# Altium schematic sheet служебный.SchDoc
size 420 x 297 mm; SheetNumber: 1; SheetTotal: 6
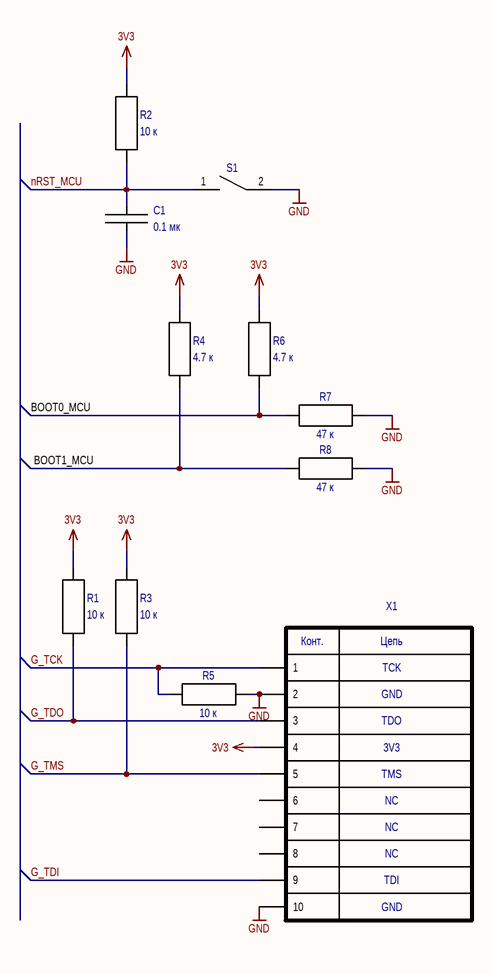
[diagram p0: служебный.SchDoc]

## Parts
C1  value 0.1 мк  (hidden comment: 0.1 мкФ ±* * * *, *)
R1  value 10 к
R2  value 10 к
R3  value 10 к
R4  value 4.7 к
R5  value 10 к
R6  value 4.7 к
R7  value 47 к
R8  value 47 к
S1  Тактильный переключатель KLS7-TS6604-4.3-180-B KLS  (value not drawn)
X1  1: GND  2: 3V3  4: TMS  6: TCK  8: TDO  10: TDI  12: NC  (hidden comment: KONT_POLE_JTAG14)

## Nets
3V3: R1.1 R2.1 R3.1 R4.1 R6.1 X1.4
GND: C1.1 R5.2 R7.2 R8.2 S1.2 X1.2 X1.10
BOOT0_MCU: R6.2 R7.1
BOOT1_MCU: R4.2 R8.1
G_TCK: R5.1 X1.1
G_TDI: X1.9
G_TDO: R1.2 X1.3
G_TMS: R3.2 X1.5
nRST_MCU: C1.2 R2.2 S1.1

Not connected (* = marked no-connect by the designer): X1 6 7 8

## Notes on the sheet
- Перв.примен.
- Справ. №
- Подп. и дата
- Инв.№ дубл.
- Взам. инв. №
- Изм.
- Лист
- № докум.
- Подп.
- Дата
- Лит.
- Масса
- Масштаб
- Пров.
- Т.контр
- Разраб.
- Схема электрическая принципиальная
- 1
- Листов
- Инв № подл.
- Н.контр.
- Утв.
- Копировал
- Формат А3
- (in symbol KONT_POLE_JTAG10) Конт.; Цепь

## Library data of the parts
C1 = C: Company: *; PartNumber: *; Tolerance: *; Voltage: *; Type: *; Package: *
R1-R8 = R_1: Company: *; PartNumber: *; Package: *; Tolerance: *
S1 = BTN: Company: KLS; PartNumber: KLS7-TS6604-4.3-180-B
X1 = KONT_POLE_JTAG10: 14: NC; 5: NC; 9: GND